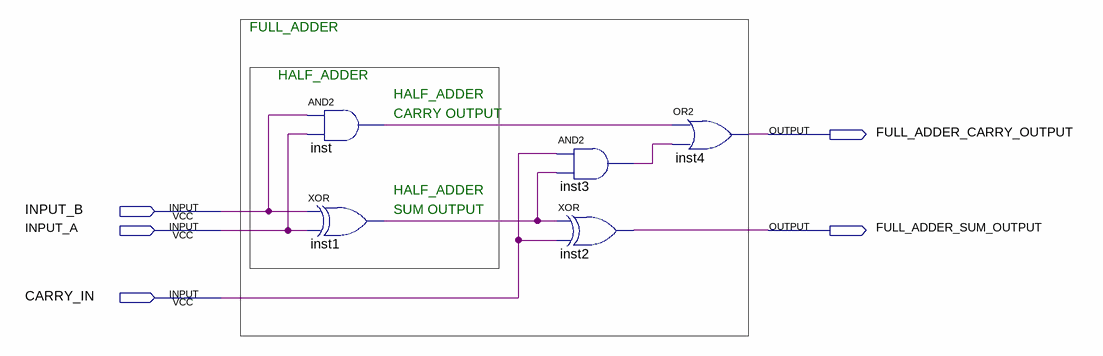
[diagram p0: schematic sheet]
// Quartus schematic full_adder_1bit.bdf as structural Verilog: 5 symbols, 5 pins
module full_adder_1bit (
  input  INPUT_B,
  input  INPUT_A,
  input  CARRY_IN,
  output FULL_ADDER_CARRY_OUTPUT,
  output FULL_ADDER_SUM_OUTPUT
);

  wire inst1_out, inst3_out, inst_out;

  and inst (inst_out, INPUT_B, INPUT_A);
  xor inst1 (inst1_out, INPUT_B, INPUT_A);
  and inst3 (inst3_out, CARRY_IN, inst1_out);
  xor inst2 (FULL_ADDER_SUM_OUTPUT, inst1_out, CARRY_IN);
  or inst4 (FULL_ADDER_CARRY_OUTPUT, inst_out, inst3_out);

  // Notes on the sheet:
  //   FULL_ADDER
  //   HALF_ADDER
  //   HALF_ADDER
  //   CARRY OUTPUT
  //   HALF_ADDER
  //   SUM OUTPUT
endmodule
